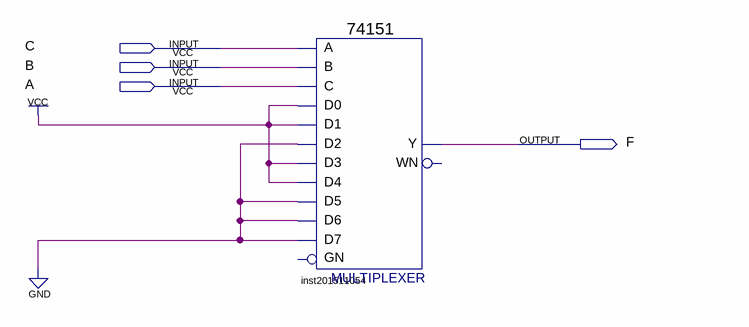
[diagram p0: schematic sheet]
// Quartus schematic lab04_2_1.bdf as structural Verilog: 1 symbols, 4 pins
module lab04_2_1 (
  input  C,
  input  B,
  input  A,
  output F
);

  \74151  inst201511054 (
    .C(A), .B(B), .A(C), .D5(1'b0), .D0(1'b1), .D1(1'b1), .D4(1'b1), .D3(1'b1), .D2(1'b0), .D6(1'b0),
    .D7(1'b0), .Y(F));  // open: GN, WN
endmodule
